# Altium schematic sheet connectors.SchDoc
size A; SheetNumber: 3; SheetTotal: 4
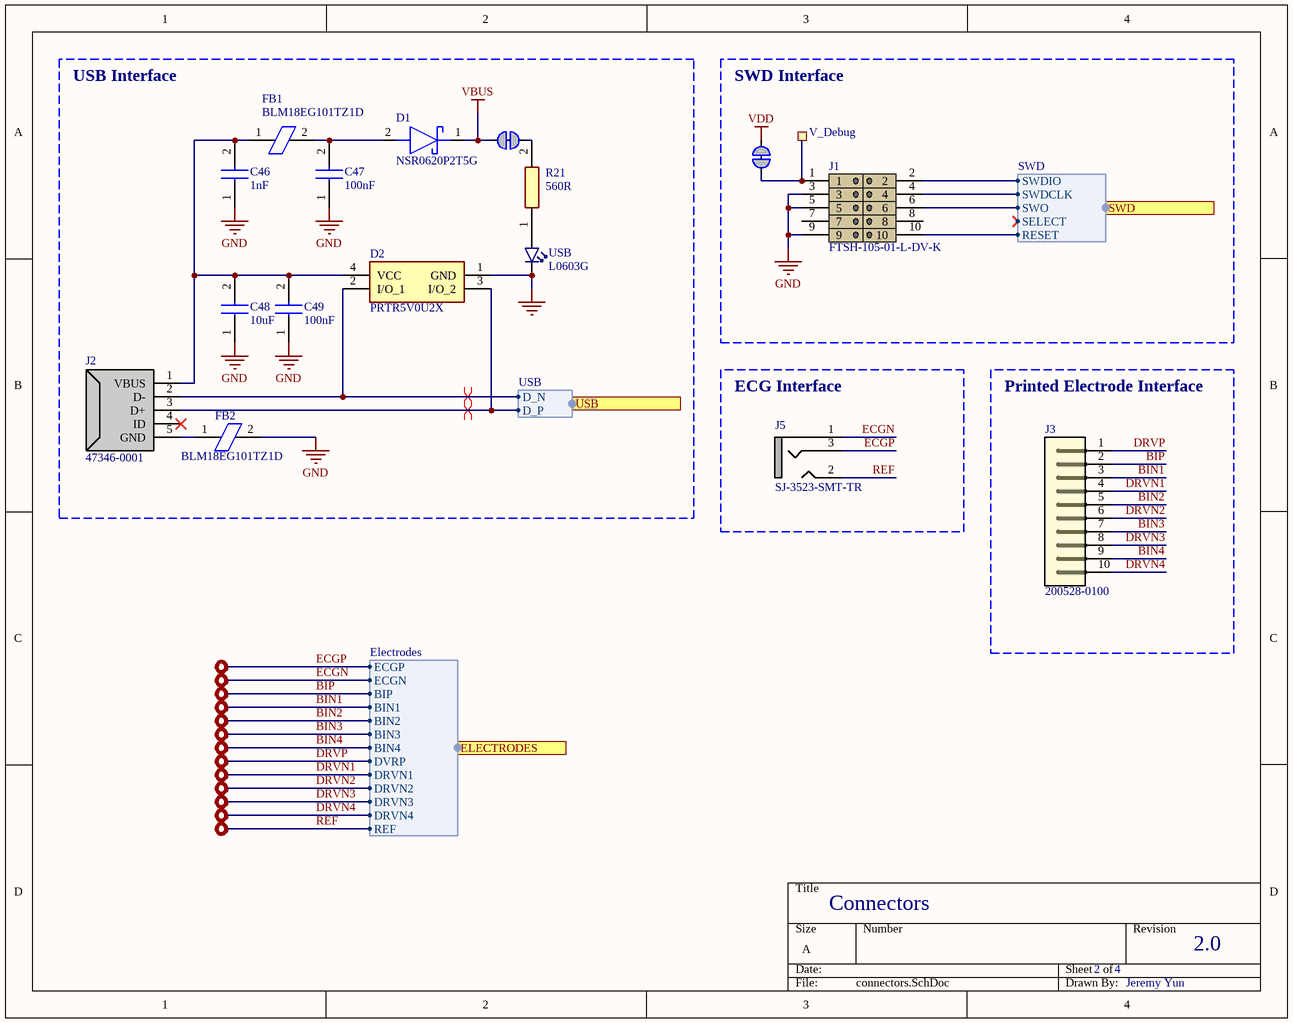
[diagram p0: connectors.SchDoc]

## Parts
C46  1nF  [C0402]
C47  100nF  [CAPC1005X55N]
C48  10uF  [C1210]
C49  100nF  [CAPC1005X55N]
D1  NSR0620P2T5G  [SODFL1006X40N]
D2  PRTR5V0U2X  [PRTR5V0U2X]
FB1  BLM18EG101TZ1D  [BLM18EG101TH1D]
FB2  BLM18EG101TZ1D  [BLM18EG101TH1D]
J1  FTSH-105-01-L-DV-K  [FTSH10501LDVK]
J2  47346-0001  [47346-0001]
J3  200528-0100  [2005280100]
J5  SJ-3523-SMT-TR  [SJ3523SMTTR]
R21  560R  [RESC1005X40N]
SB12  Solderbridge  [Solderbridge_Shorted]  (value not drawn)  (net tie, no BOM)
SWD_VDD  Solderbridge  [Solderbridge_Shorted]  (value not drawn)  (net tie, no BOM)
USB  L0603G  [LED_0603_G]
V_Debug  Ø1.0mm,SMD  [TP_SMD_D1.0mm]  (value not drawn)  (no BOM)

## Blocks framed on the sheet
USB Interface: C46-C49 D1 D2 FB1 FB2 J2 R21 SB12 USB
SWD Interface: J1 SWD_VDD V_Debug
ECG Interface: J5
Printed Electrode Interface: J3

## Ports
ELECTRODES (harness Electrodes), SWD (harness SWD), USB (harness USB)

## Harnesses
SWD: SWDIO, SWDCLK, SWO, RESET, SELECT
USB: D_P, D_N
Electrodes: ECGP, ECGN, BIN1, BIP, BIN2, BIN3, BIN4, DVRP, DRVN1, DRVN3, DRVN2, DRVN4, REF

## Nets
GND: C46.1 C47.1 C48.1 C49.1 D2.1(GND) FB2.2 J1.3 J1.5 J1.9 USB.1(C)
VBUS: D1.1(K) SB12.1
VDD: SWD_VDD.2
BIN1: J3.3 ; port ELECTRODES.BIN1
BIN2: J3.5 ; port ELECTRODES.BIN2
BIN3: J3.7 ; port ELECTRODES.BIN3
BIN4: J3.9 ; port ELECTRODES.BIN4
BIP: J3.2 ; port ELECTRODES.BIP
DRVN1: J3.4 ; port ELECTRODES.DRVN1
DRVN2: J3.6 ; port ELECTRODES.DRVN2
DRVN3: J3.8 ; port ELECTRODES.DRVN3
DRVN4: J3.10 ; port ELECTRODES.DRVN4
DRVP: J3.1 ; port ELECTRODES.DVRP
ECGN: J5.1 ; port ELECTRODES.ECGN
ECGP: J5.3 ; port ELECTRODES.ECGP
REF: J5.2 ; port ELECTRODES.REF
NetC46_2: C46.2 C48.2 C49.2 D2.4(VCC) FB1.1 J2.1(VBUS)
NetC47_2: C47.2 D1.2(A) FB1.2
NetD2_2: D2.2(I/O_1) J2.2(D-) ; port USB.D_N
NetD2_3: D2.3(I/O_2) J2.3(D+) ; port USB.D_P
NetFB2_1: FB2.1 J2.5(GND)
NetJ1_1: J1.1 SWD_VDD.1 V_Debug.1
NetJ1_2: J1.2 ; port SWD.SWDIO
NetJ1_4: J1.4 ; port SWD.SWDCLK
NetJ1_6: J1.6 ; port SWD.SWO
NetJ1_10: J1.10 ; port SWD.RESET
NetR21_1: R21.1 USB.2(A)
NetR21_2: R21.2 SB12.2

Not connected (* = marked no-connect by the designer): J1 7 8; J2 4(ID)*

## Layout directives
differential pair: NetD2_2, NetD2_3

## Notes on the sheet
- Connectors
- 2
- 4
- 2.0
- Jeremy Yun

## Library data of the parts
C46 = C0402C102J1GEC7411: Capacitor; Manufacturer_Name: KEMET; Datasheet Link: https://content.kemet.com/datasheets/KEM_C1091_C0G_ESD.pdf; Height: 0.55mm; Manufacturer_Part_Number: C0402C102J1GEC7411; Mouser Part Number: 80-C0402C102J1GECLR; Mouser Price/Stock: https://www.mouser.co.uk/ProductDetail/KEMET/C0402C102J1GEC7411?qs=55YtniHzbhDbMp4X17Pi5A%3D%3D
C47 C49 = CL05B104KP5VPNC: Capacitor; Manufacturer_Name: SAMSUNG; Datasheet Link: https://product.samsungsem.com/mlcc/CL05B104KP5VPN.do; Height: 0.55mm; Manufacturer_Part_Number: CL05B104KP5VPNC; Mouser Part Number: 187-CL05B104KP5VPNC; Mouser Price/Stock: https://www.mouser.co.uk/ProductDetail/Samsung-Electro-Mechanics/CL05B104KP5VPNC?qs=gqBM4hNBiUXTv%252BkFO9q2pQ%3D%3D
C48 = C1210C106Z4VACTU: Capacitor; Manufacturer_Name: KEMET; Datasheet Link: https://content.kemet.com/datasheets/KEM_C1005_Y5V_SMD.pdf; Manufacturer_Part_Number: C1210C106Z4VACTU; Mouser Part Number: 80-C1210C106Z4V; Mouser Price/Stock: https://www.mouser.co.uk/ProductDetail/KEMET/C1210C106Z4VACTU?qs=mv3KgORg%2FP46M9Lyxvcz2A%3D%3D
D1 = NSR0620P2T5G: Schottky Diode; Manufacturer_Name: onsemi; Datasheet Link: https://www.onsemi.com/pub/Collateral/NSR0620P2-D.PDF; Height: 0.4mm; Manufacturer_Part_Number: NSR0620P2T5G; Mouser Part Number: 863-NSR0620P2T5G; Mouser Price/Stock: https://www.mouser.co.uk/ProductDetail/onsemi/NSR0620P2T5G?qs=tauDy9ytPRuGG8VMIU8l1w%3D%3D; Arrow Part Number: NSR0620P2T5G; Arrow Price/Stock: https://www.arrow.com/en/products/nsr0620p2t5g/on-semiconductor?region=nac
D2 = PRTR5V0U2X: Clamp Ipp Tvs Diode Surface Mount SOT-143B; Manufacturer_Name: Nexperia; Datasheet Link: https://assets.nexperia.com/documents/data-sheet/PRTR5V0U2X.pdf; Height: 1.1mm; Manufacturer_Part_Number: PRTR5V0U2X; Mouser Part Number: N/A; Mouser Price/Stock: https://www.mouser.co.uk/ProductDetail/Nexperia/PRTR5V0U2X?qs=vHuUswq2%252BsxqVTVM0kNyWw%3D%3D
FB1 FB2 = BLM18EG101TZ1D: Ferrite Bead; Manufacturer_Name: Murata Electronics; Datasheet Link: http://www.murata.com/~/media/webrenewal/support/library/catalog/products/emc/emifil/c31e.ashx?la=en-gb; Height: 0.75mm; Manufacturer_Part_Number: BLM18EG101TZ1D; Mouser Part Number: 81-BLM18EG101TZ1D; Mouser Price/Stock: https://www.mouser.co.uk/ProductDetail/Murata-Electronics/BLM18EG101TZ1D?qs=lEfY3O89Aql3C2AEBXMxiA%3D%3D
J1 = FTSH-105-01-L-DV-K: Connector; Manufacturer_Name: SAMTEC; Datasheet Link: https://www.arrow.com/en/products/ftsh-105-01-l-dv-k/samtec; Height: 6.1mm; Manufacturer_Part_Number: FTSH-105-01-L-DV-K; Mouser Part Number: 200-FTSH10501LDVK; Mouser Price/Stock: https://www.mouser.co.uk/ProductDetail/Samtec/FTSH-105-01-L-DV-K?qs=%252B5JSS813miOqo3Vy%252BvhCFg%3D%3D; Arrow Part Number: FTSH-105-01-L-DV-K; Arrow Price/Stock: https://www.arrow.com/en/products/ftsh-105-01-l-dv-k/samtec?region=europe
J2 = 47346-0001: Connector; Manufacturer_Name: Molex; Datasheet Link: http://www.molex.com/pdm_docs/sd/473460001_sd.pdf; Manufacturer_Part_Number: 47346-0001; Mouser Part Number: 538-47346-0001; Mouser Price/Stock: https://www.mouser.co.uk/ProductDetail/Molex/47346-0001?qs=c2CV6XM0DweJBWaSeyWeCw%3D%3D
J3 = 200528-0100: Connector; Manufacturer_Name: Molex; Datasheet Link: https://www.molex.com/pdm_docs/sd/2005280100_sd.pdf; Height: 2.1mm; Manufacturer_Part_Number: 200528-0100; Mouser Part Number: 538-200528-0100; Mouser Price/Stock: https://www.mouser.co.uk/ProductDetail/Molex/200528-0100?qs=0lSvoLzn4L%2F78iVrqdBtRg%3D%3D
J5 = SJ-3523-SMT-TR: Connector; Manufacturer_Name: CUI Devices; Datasheet Link: https://www.mouser.de/datasheet/2/670/sj_352x_smt-1779397.pdf; Height: 5.2mm; Manufacturer_Part_Number: SJ-3523-SMT-TR; Mouser Part Number: 490-SJ-3523-SMT-TR; Mouser Price/Stock: https://www.mouser.co.uk/ProductDetail/CUI-Devices/SJ-3523-SMT-TR?qs=WyjlAZoYn51zOHzJ3r4ZRA%3D%3D; Arrow Part Number: SJ-3523-SMT-TR; Arrow Price/Stock: https://www.arrow.com/en/products/sj-3523-smt-tr/cui-devices?region=europe
R21 = RC0402JR-07560RL: Resistor; Manufacturer_Name: KEMET; Datasheet Link: http://www.yageo.com/documents/recent/PYu-RC0402_51_RoHS_L_6_r.pdf; Height: 0.4mm; Manufacturer_Part_Number: RC0402JR-07560RL; Mouser Part Number: 603-RC0402JR-07560RL; Mouser Price/Stock: https://www.mouser.com/Search/Refine.aspx?Keyword=603-RC0402JR-07560RL
SB12 SWD_VDD = Solderbridge Shorted: Shorted Solderbridge; Manufacturer: N.A.; Pad Count: 2; Part Number: Solderbridge Shorted; Manufacturer Part Number: N.A.; LatestRevisionDate: 2012-08-07; Pin Count: 2; Publisher: Nordic Semiconductor; Published: 2012-08-07; Value: Solderbridge; Note: N.A.; Artikkelnr Noca: N.A.; Footprint Doc: Solderbridge_Shorted; Part number IPS: N.A.; ComponentLink1URL: N.A.; ComponentLink1Description: Datasheet; ComponentLink2URL: N.A.; ComponentLink2Description: Supplier link; HelpURL: N.A.; Supplier 1: N.A.; Supplier Part Number 1: N.A.; Supplier 2: N.A.; Supplier Part Number 2: N.A.; Author: rsk; Component Class: Connectors; PartId: 100500459; Part number Norautron: N.A.
USB = VS 25C7M5: LED, Green, 0603, 573nm, Vf=2.0V, 24mcd, - 40 to +85°C; Manufacturer: Victory Electronics; Part number IPS: 00000001274, 00000009961; Note: N.A.; Artikkelnr Noca: 13019193; Pad Count: 2; Part Number: VS 25C7M5; Manufacturer Part Number: VS 25C7M5; Footprint Doc: 0603; LatestRevisionDate: 2020-10-23; Published: 2017-08-21; Value: L0603G; ComponentLink1URL: N.A.; ComponentLink1Description: Datasheet; ComponentLink2URL: N.A.; ComponentLink2Description: Supplier link; HelpURL: \\hizz\pro\app9717\Datasheet\optoelectronics\Victory Electronics\VS 25C7M5.pdf; Supplier 1: EC Partner; Supplier Part Number 1: N.A.; Supplier 2: N.A.; Supplier Part Number 2: N.A.; PartId: 101400097; Component Class: Optoelectronics; Author: rsk; Part number Norautron: N.A.
V_Debug = TP_SMD_Ø1.0MM: 1.0mm circular SMD testpad; Manufacturer: Nordic Semiconductor; Manufacturer Part Number: N.A.; Pad Count: 1; Part Number: TP_SMD_Ø1.0MM; LatestRevisionDate: 2021-03-05; Pin Count: 1; Publisher: Nordic Semiconductor; Published: 2013-06-11; Value: Ø1.0mm,SMD; Note: N.A.; Artikkelnr Noca: N.A.; Footprint Doc: TP_SMD_Ø1.0mm; Part number IPS: N.A.; ComponentLink1URL: N.A.; ComponentLink1Description: Datasheet; ComponentLink2URL: N.A.; ComponentLink2Description: Supplier link; HelpURL: N.A.; Supplier 1: N.A.; Supplier Part Number 1: N.A.; Supplier 2: N.A.; Supplier Part Number 2: N.A.; Author: rsk; Component Class: Connectors; PartId: 100500475; Part number Norautron: N.A.